# Altium schematic sheet sla2216-conn-dut.SchDoc
size A4; DocumentNumber: 4; SheetNumber: 4; SheetTotal: 6
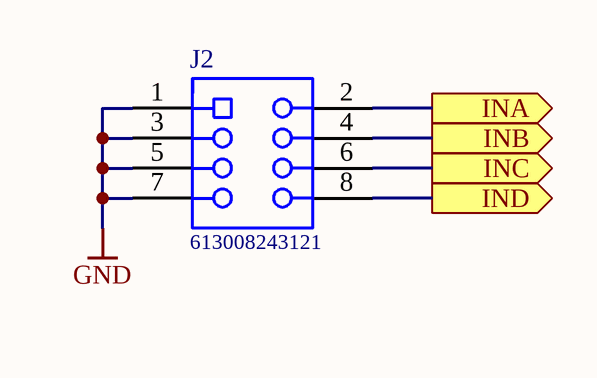
[diagram p0: sla2216-conn-dut.SchDoc]

## Parts
J2  613008243121  [613008243121]

## Ports
INA (out), INB (out), INC (out), IND (out)

## Nets
GND: J2.1 J2.3 J2.5 J2.7
INA: J2.2 ; port INA
INB: J2.4 ; port INB
INC: J2.6 ; port INC
IND: J2.8 ; port IND

## Library data of the parts
J2 = CMP-1502-01417-1: THT Angled Socket Header WR-PHD, Pitch 2.54 mm, Dual Row, 8 pins; Manufacturer: Wurth Elektronik; Rated Current: 3A; Pitch: 2.54mm; Contact Resistance: 20mOhm; Gender: Female; Withstanding Voltage: 500VAC; Working Voltage: 250VAC; Pin Number: 8; Row Number: Dual; Operating Temperature: -40to125degC; Packaging: Tray; Manufacturer URL: http://www.we-online.de; Mounting Technology: THT; Package Reference: 613008243121; Orientation: Angled; Part Number: 613008243121; Publisher: WurthElektronik; Datasheet URL: https://katalog.we-online.de/em/datasheet/6130xx243121.pdf